# Altium schematic sheet SCH_POWER_5V_to_3.3V.SchDoc
size A; SheetNumber: 3; SheetTotal: 3
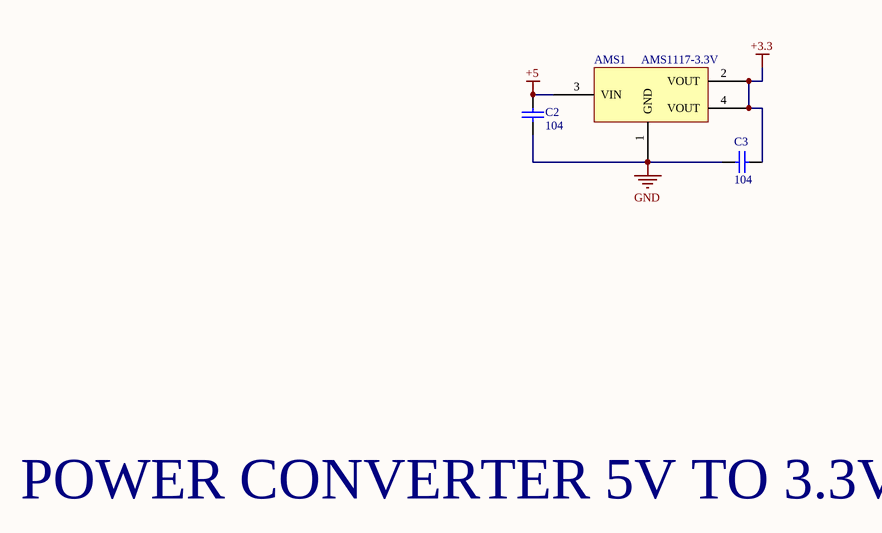
[diagram p0: SCH_POWER_5V_to_3.3V.SchDoc]

## Parts
AMS1  AMS1117-3.3V  [SOT223]
C2  104  [tu 0603]
C3  104  [tu 0603]

## Nets
+3.3: AMS1.2(VOUT) AMS1.4(VOUT) C3.2
+5: AMS1.3(VIN) C2.2
GND: AMS1.1(GND) C2.1 C3.1

## Notes on the sheet
- POWER CONVERTER 5V TO 3.3V

## Library data of the parts
AMS1 = AMS1117 SMD: Dán; Value: AMS1117-3.3V SOT223; Don_Vi: Con; Ma_Hang: MH000596; Ghi_Chu: *; Kieu_Chan: *; Chung_Loai: Dán
C2 C3 = Tu 0603 106 16V 20%: Dán; Don_Vi: Con; So_Chan: 2; Ten_Linh_Kien: Tụ 0603-10uF 20% 16V; Ma_Hang: MH004848; Chung_Loai: Dán; Kieu_Chan: *